# Altium schematic sheet Strain Gauge Amplifiers.SchDoc: SG Amplifiers
size Letter; Date: Jul 31/2018; Revision: 1; SheetNumber: 6; SheetTotal: 9
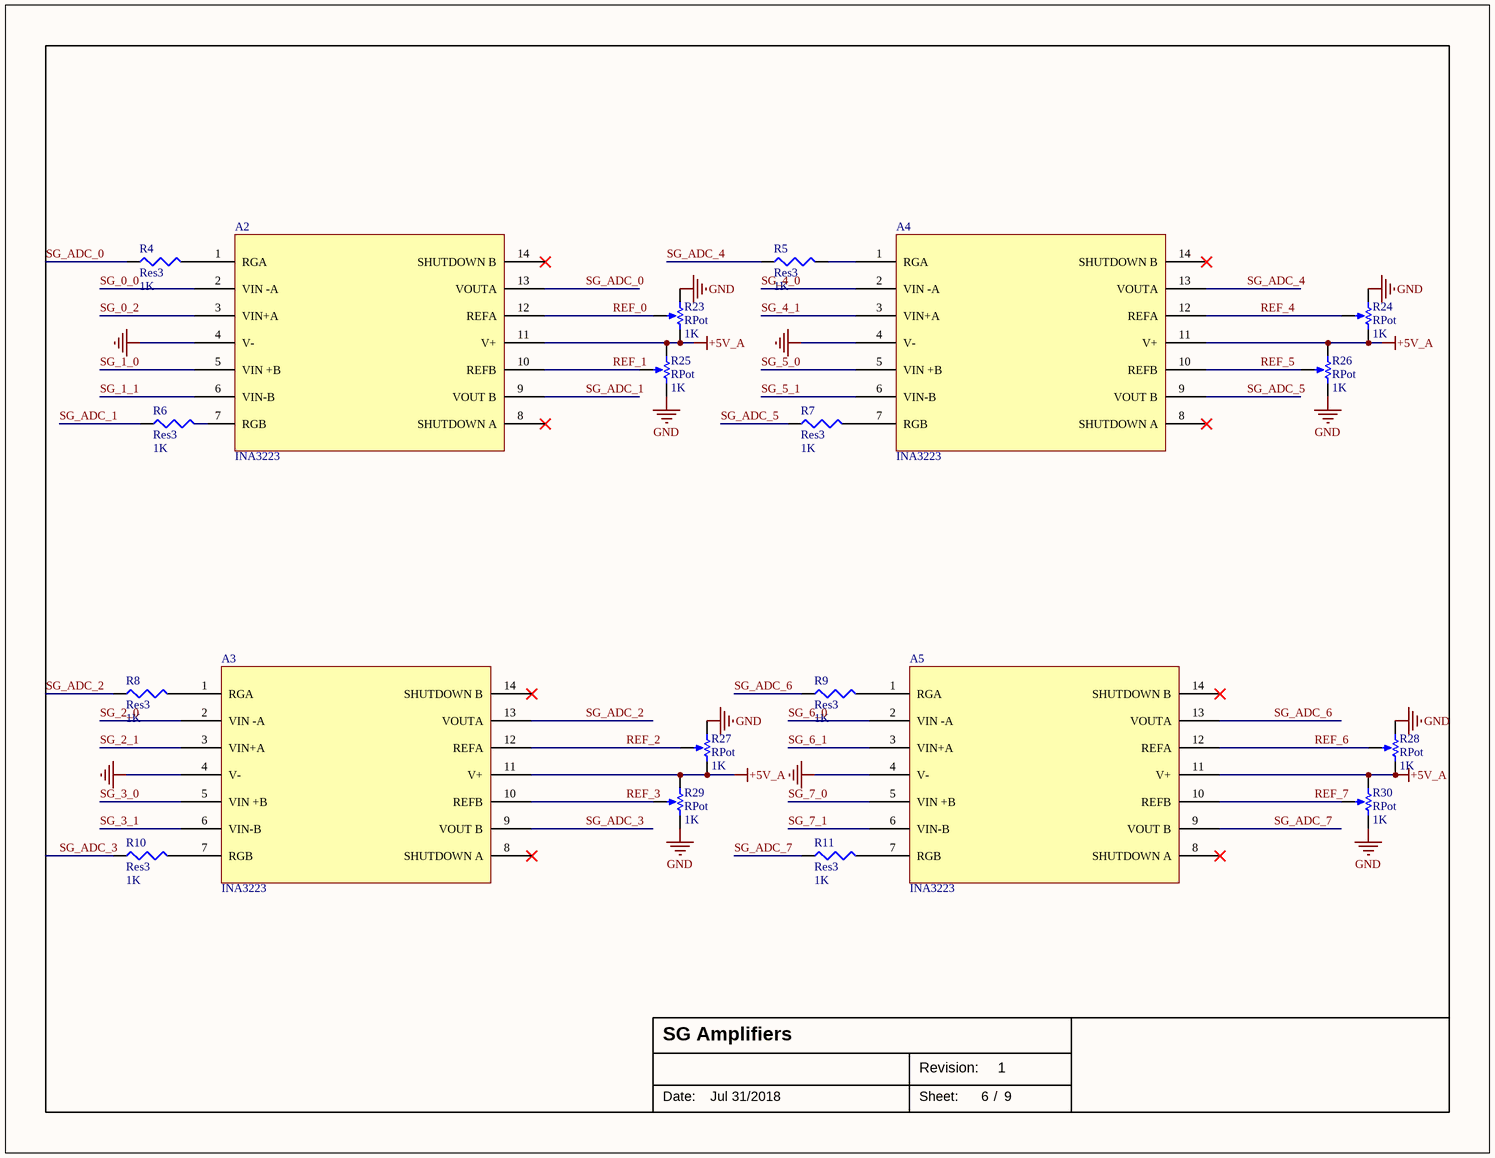
[diagram p0: Strain Gauge Amplifiers.SchDoc]

## Parts
A2  INA3223  [TSSOP-14]
A3  INA3223  [TSSOP-14]
A4  INA3223  [TSSOP-14]
A5  INA3223  [TSSOP-14]
R4  Res3  value 1K  [1206]
R5  Res3  value 1K  [1206]
R6  Res3  value 1K  [1206]
R7  Res3  value 1K  [1206]
R8  Res3  value 1K  [1206]
R9  Res3  value 1K  [1206]
R10  Res3  value 1K  [1206]
R11  Res3  value 1K  [1206]
R23  RPot  value 1K  [POT]
R24  RPot  value 1K  [POT]
R25  RPot  value 1K  [POT]
R26  RPot  value 1K  [POT]
R27  RPot  value 1K  [POT]
R28  RPot  value 1K  [POT]
R29  RPot  value 1K  [POT]
R30  RPot  value 1K  [POT]

## Nets
+5V_A: A2.11(V+) A3.11(V+) A4.11(V+) A5.11(V+) R23.2(BOT) R24.2(BOT) R25.1(TOP) R26.1(TOP) R27.2(BOT) R28.2(BOT) R29.1(TOP) R30.1(TOP)
GND: A2.4(V-) A3.4(V-) A4.4(V-) A5.4(V-) R23.1(TOP) R24.1(TOP) R25.2(BOT) R26.2(BOT) R27.1(TOP) R28.1(TOP) R29.2(BOT) R30.2(BOT)
REF_0: A2.12(REFA) R23.3(TAP)
REF_1: A2.10(REFB) R25.3(TAP)
REF_2: A3.12(REFA) R27.3(TAP)
REF_3: A3.10(REFB) R29.3(TAP)
REF_4: A4.12(REFA) R24.3(TAP)
REF_5: A4.10(REFB) R26.3(TAP)
REF_6: A5.12(REFA) R28.3(TAP)
REF_7: A5.10(REFB) R30.3(TAP)
SG_0_0: A2.2(VIN_-A)
SG_0_2: A2.3(VIN+A)
SG_1_0: A2.5(VIN_+B)
SG_1_1: A2.6(VIN-B)
SG_2_0: A3.2(VIN_-A)
SG_2_1: A3.3(VIN+A)
SG_3_0: A3.5(VIN_+B)
SG_3_1: A3.6(VIN-B)
SG_4_0: A4.2(VIN_-A)
SG_4_1: A4.3(VIN+A)
SG_5_0: A4.5(VIN_+B)
SG_5_1: A4.6(VIN-B)
SG_6_0: A5.2(VIN_-A)
SG_6_1: A5.3(VIN+A)
SG_7_0: A5.5(VIN_+B)
SG_7_1: A5.6(VIN-B)
SG_ADC_0: A2.13(VOUTA) R4.1
SG_ADC_1: A2.9(VOUT_B) R6.1
SG_ADC_2: A3.13(VOUTA) R8.1
SG_ADC_3: A3.9(VOUT_B) R10.1
SG_ADC_4: A4.13(VOUTA) R5.1
SG_ADC_5: A4.9(VOUT_B) R7.1
SG_ADC_6: A5.13(VOUTA) R9.1
SG_ADC_7: A5.9(VOUT_B) R11.1
NetA2_1: A2.1(RGA) R4.2
NetA2_7: A2.7(RGB) R6.2
NetA3_1: A3.1(RGA) R8.2
NetA3_7: A3.7(RGB) R10.2
NetA4_1: A4.1(RGA) R5.2
NetA4_7: A4.7(RGB) R7.2
NetA5_1: A5.1(RGA) R9.2
NetA5_7: A5.7(RGB) R11.2

Not connected (* = marked no-connect by the designer): A2 8(SHUTDOWN_A)* 14(SHUTDOWN_B)*; A3 8(SHUTDOWN_A)* 14(SHUTDOWN_B)*; A4 8(SHUTDOWN_A)* 14(SHUTDOWN_B)*; A5 8(SHUTDOWN_A)* 14(SHUTDOWN_B)*

## Notes on the sheet
- Date:
- Revision:
- Sheet:
- /

## Library data of the parts
R4-R11 = Res3: Resistor; Published: 8-Jun-2000; LatestRevisionDate: 29-May-2009; LatestRevisionNote: IPC-7351 Footprint Added.; PackageReference: J1-0603; Publisher: Altium Limited; PackageDescription: Chip Resistor
R23-R30 = RPot: Potentiometer; Sim Note: Enter the Resistance value and the set point into parameter fields.; Set Position: 0.5; Published: 8-Jun-2000; LatestRevisionDate: 17-Jul-2002; LatestRevisionNote: Re-released for DXP Platform.; PackageReference: VR5; Publisher: Altium Limited; PackageDescription: Variable Resistor, Thru-Hole; 3 Leads